# Altium schematic sheet 2020年电赛校赛电源板.SchDoc
size A4
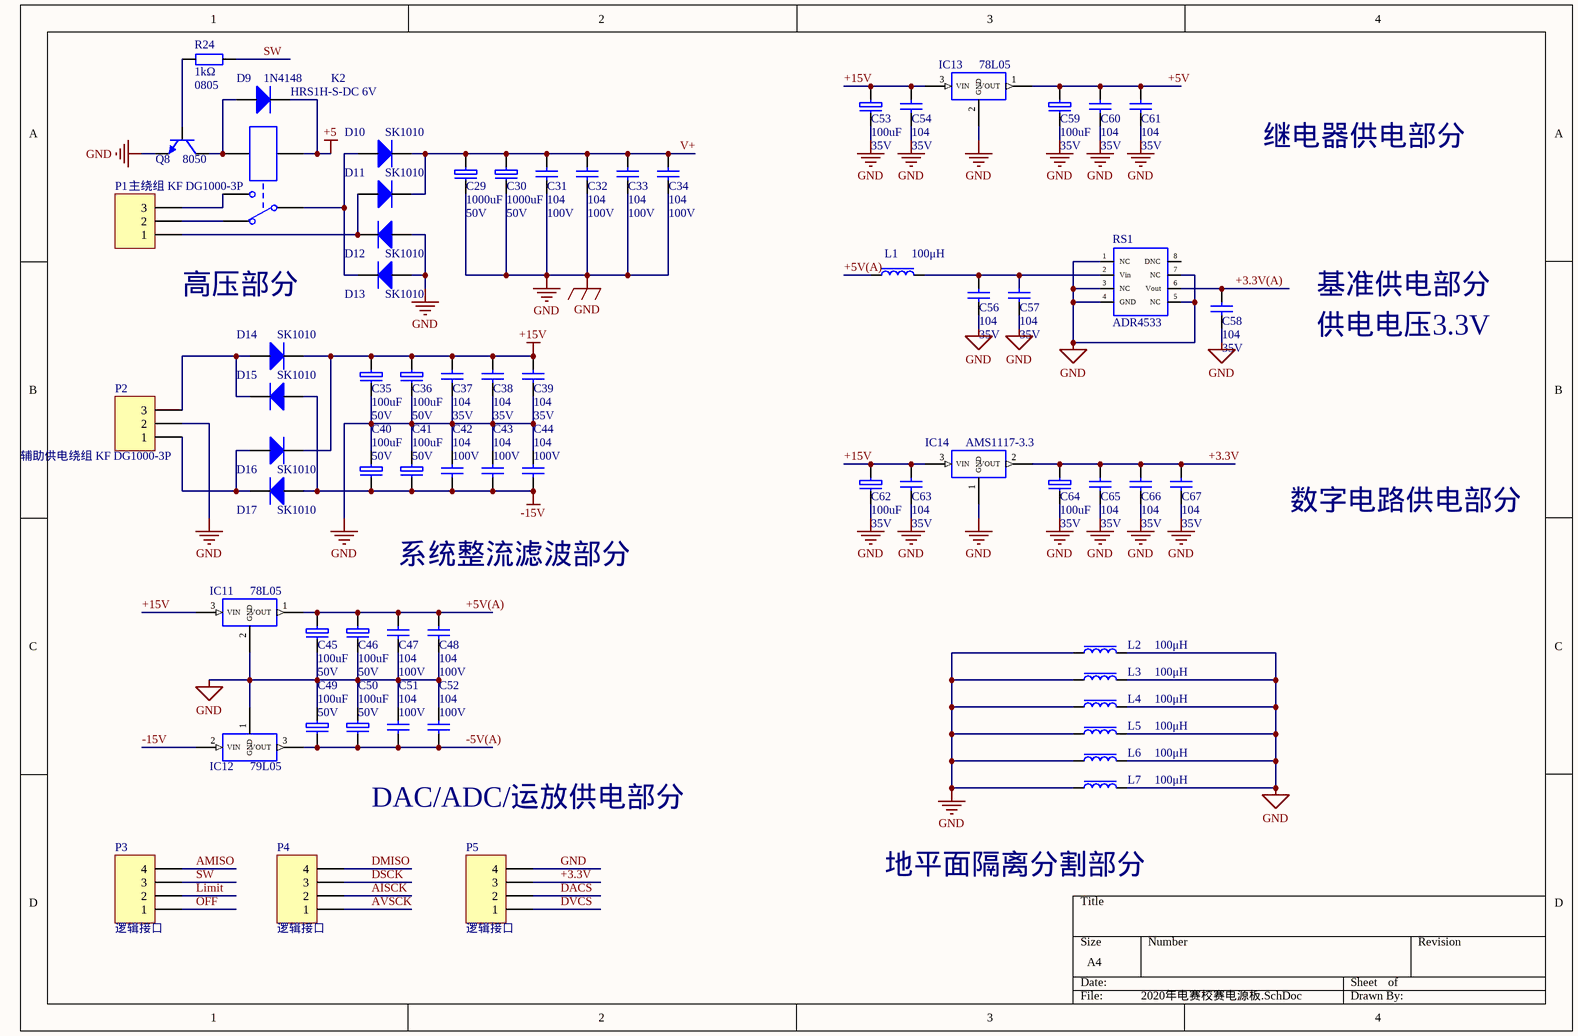
[diagram p0: 2020年电赛校赛电源板.SchDoc]

## Parts
C29  1000uF  value 50V  [CR132(Φ13.2,间距5.1)]
C30  1000uF  value 50V  [CR132(Φ13.2,间距5.1)]
C31  104  value 100V  [C0805]
C32  104  value 100V  [C0805]
C33  104  value 100V  [C0805]
C34  104  value 100V  [C0805]
C35  100uF  value 50V  [CR100(Φ10.0,间距4.9）]
C36  100uF  value 50V  [CR100(Φ10.0,间距4.9）]
C37  104  value 35V  [C0805]
C38  104  value 35V  [C0805]
C39  104  value 35V  [C0805]
C40  100uF  value 50V  [CR100(Φ10.0,间距4.9）]
C41  100uF  value 50V  [CR100(Φ10.0,间距4.9）]
C42  104  value 100V  [C0805]
C43  104  value 100V  [C0805]
C44  104  value 100V  [C0805]
C45  100uF  value 50V  [CR100(Φ10.0,间距4.9）]
C46  100uF  value 50V  [CR100(Φ10.0,间距4.9）]
C47  104  value 100V  [C0805]
C48  104  value 100V  [C0805]
C49  100uF  value 50V  [CR100(Φ10.0,间距4.9）]
C50  100uF  value 50V  [CR100(Φ10.0,间距4.9）]
C51  104  value 100V  [C0805]
C52  104  value 100V  [C0805]
C53  100uF  value 35V  [CR100(Φ10.0,间距4.9）]
C54  104  value 35V  [C0805]
C56  104  value 35V  [C0805]
C57  104  value 35V  [C0805]
C58  104  value 35V  [C0805]
C59  100uF  value 35V  [CT 10*6 - C]
C60  104  value 35V  [C0805]
C61  104  value 35V  [C0805]
C62  100uF  value 35V  [CR100(Φ10.0,间距4.9）]
C63  104  value 35V  [C0805]
C64  100uF  value 35V  [CT 10*6 - C]
C65  104  value 35V  [C0805]
C66  104  value 35V  [C0805]
C67  104  value 35V  [C0805]
D9  1N4148  [LL34]
D10  SK1010  [SMC(DO-214AB)]
D11  SK1010  [SMC(DO-214AB)]
D12  SK1010  [SMC(DO-214AB)]
D13  SK1010  [SMC(DO-214AB)]
D14  SK1010  [SMC(DO-214AB)]
D15  SK1010  [SMC(DO-214AB)]
D16  SK1010  [SMC(DO-214AB)]
D17  SK1010  [SMC(DO-214AB)]
IC11  78L05  [SOT-89]
IC12  79L05  [SOT-89]
IC13  78L05  [SOT-89]
IC14  AMS1117-3.3  [SOT-89]
K2  HRS1H-S-DC 6V  [继电器]
L1  100μH  [R0805]
L2  100μH  [R0805]
L3  100μH  [R0805]
L4  100μH  [R0805]
L5  100μH  [R0805]
L6  100μH  [R0805]
L7  100μH  [R0805]
P1  主绕组 KF DG1000-3P  [KF7.62-3P]
P2  辅助供电绕组 KF DG1000-3P  [KF7.62-3P]
P3  逻辑接口  [XH2.54-4P]
P4  逻辑接口  [XH2.54-4P]
P5  逻辑接口  [XH2.54-4P]
Q8  8050  [SOT-23]
R24  1kΩ  value 0805  [R0805]
RS1  ADR4533  [SOP-8(体宽3.8mm)]

## Nets
+5: D9.2(K) K2.2
+15V: C35.1(+) C36.1(+) C37.2 C38.2 C39.2 C53.1(+) C54.2 C62.1(+) C63.2 D14.2(K) D16.2(K) IC11.3(VIN) IC13.3(VIN) IC14.3(VIN)
-15V: C40.2(-) C41.2(-) C42.1 C43.1 C44.1 D15.1(A) D17.1(A) IC12.2(VIN)
GND: C29.2(-) C30.2(-) C31.1 C32.1 C33.1 C34.1 C35.2(-) C36.2(-) C37.1 C38.1 C39.1 C40.1(+) C41.1(+) C42.2 C43.2 C44.2 C45.2(-) C46.2(-) C47.1 C48.1 C49.1(+) C50.1(+) C51.2 C52.2 C53.2(-) C54.1 C56.1 C57.1 C58.1 C59.2(-) C60.1 C61.1 C62.2(-) C63.1 C64.2(-) C65.1 C66.1 C67.1 D12.1(A) D13.1(A) IC11.2(GND) IC12.1(GND) IC13.2(GND) IC14.1(GND) L2.1 L2.2 L3.1 L3.2 L4.1 L4.2 L5.1 L5.2 L6.1 L6.2 L7.1 L7.2 P2.2 P5.4 Q8.3(E) RS1.1(NC) RS1.3(NC) RS1.4(GND) RS1.5(NC) RS1.7(NC)
+3.3V: C64.1(+) C65.2 C66.2 C67.2 IC14.2(VOUT) P5.3
+3.3V(A): C58.2 RS1.6(Vout)
+5V: C59.1(+) C60.2 C61.2 IC13.1(VOUT)
+5V(A): C45.1(+) C46.1(+) C47.2 C48.2 IC11.1(VOUT) L1.2
-5V(A): C49.2(-) C50.2(-) C51.1 C52.1 IC12.3(VOUT)
AISCK: P4.2
AMISO: P3.4
AVSCK: P4.1
DACS: P5.2
DMISO: P4.4
DSCK: P4.3
DVCS: P5.1
Limit: P3.2
OFF: P3.1
SW: P3.3 R24.2
V+: C29.1(+) C30.1(+) C31.2 C32.2 C33.2 C34.2 D10.2(K) D11.2(K)
NetC56_2: C56.2 C57.2 L1.1 RS1.2(Vin)
NetD9_1: D9.1(A) K2.5 Q8.2(C)
NetD10_1: D10.1(A) D13.2(K) K2.4
NetD11_1: D11.1(A) D12.2(K) P1.1
NetD14_1: D14.1(A) D15.2(K) P2.3
NetD16_1: D16.1(A) D17.2(K) P2.1
NetK2_1: K2.1 P1.2
NetK2_6: K2.6 P1.3
NetQ8_1: Q8.1(B) R24.1

Not connected (* = marked no-connect by the designer): RS1 8(DNC)

## Notes on the sheet
- 继电器供电部分
- 高压部分
- 基准供电部分
- 供电电压3.3V
- 数字电路供电部分
- 系统整流滤波部分
- DAC/ADC/运放供电部分
- 地平面隔离分割部分

## Library data of the parts
C29 C30 C35 C36 C40 C41 C45 C46 C49 C50 C53 C59 C62 C64 = 100uF: 有极性电容
C31-C34 C37-C39 C42-C44 C47 C48 C51 C52 C54 C56-C58 C60 C61 C63 C65-C67 = 104: 无极性电容
D9-D17 = Diode: 二极管
IC11 IC13 IC14 = AMS1117-3.3: LDO
IC12 = 790?: LDO
K2 = HRS1H-S-DC 6V: 继电器
L1-L7 = 470mH: 电感
P1 P2 = Header 3: Header, 3-Pin; LatestRevisionDate: 17-Jul-2002; LatestRevisionNote: Re-released for DXP Platform.; Publisher: Altium Limited
P3-P5 = Header 4: Header, 4-Pin; LatestRevisionDate: 17-Jul-2002; LatestRevisionNote: Re-released for DXP Platform.; Publisher: Altium Limited
Q8 = NPN: 三极管
R24 = 10kΩ: 贴片/直插电阻
RS1 = ADR4533: 高精度基准源